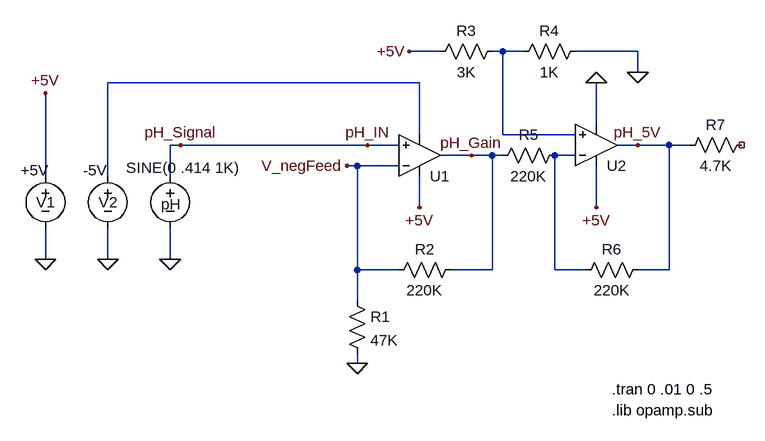
[diagram p0: schematic pHCircuit_V01.asc]
pHCircuit_V01.asc, the LTspice schematic file:
Version 4
SHEET 1 1940 680
WIRE 64 -128 16 -128
WIRE 160 -128 144 -128
WIRE 192 -128 160 -128
WIRE 368 -128 272 -128
WIRE 368 -96 368 -128
WIRE 32 -80 -448 -80
WIRE 304 -16 304 -80
WIRE 32 0 32 -80
WIRE 160 0 160 -128
WIRE 272 0 160 0
WIRE -336 16 -352 16
WIRE -48 16 -336 16
WIRE 0 16 -48 16
WIRE 368 16 336 16
WIRE 416 16 368 16
WIRE 448 16 416 16
WIRE 112 32 64 32
WIRE 144 32 112 32
WIRE 160 32 144 32
WIRE 272 32 240 32
WIRE -64 48 -80 48
WIRE 0 48 -64 48
WIRE -544 64 -544 -64
WIRE -448 64 -448 -80
WIRE -352 64 -352 16
WIRE 32 112 32 64
WIRE 304 112 304 48
WIRE -544 192 -544 144
WIRE -448 192 -448 144
WIRE -352 192 -352 144
WIRE -64 208 -64 48
WIRE 0 208 -64 208
WIRE 144 208 144 32
WIRE 144 208 80 208
WIRE 240 208 240 32
WIRE 288 208 240 208
WIRE 416 208 416 16
WIRE 416 208 368 208
WIRE -64 256 -64 208
WIRE -64 352 -64 336
FLAG -48 16 pH_IN
FLAG -352 192 0
FLAG -64 352 0
FLAG 112 32 pH_Gain
FLAG -80 48 V_negFeed
FLAG -448 192 0
FLAG -336 16 pH_Signal
FLAG 32 112 +5V
FLAG -544 -64 +5V
FLAG -544 192 0
FLAG 304 112 +5V
FLAG 304 -80 0
FLAG 368 -96 0
FLAG 16 -128 +5V
FLAG 368 16 pH_5V
SYMBOL voltage -352 48 R0
WINDOW 3 -68 3 Left 2
WINDOW 123 -249 109 Left 2
WINDOW 39 0 0 Left 2
WINDOW 0 -14 59 Left 2
SYMATTR Value SINE(0 .414 1K)
SYMATTR InstName pH
SYMBOL res 96 192 R90
WINDOW 0 0 56 VBottom 2
WINDOW 3 32 56 VTop 2
SYMATTR InstName R2
SYMATTR Value 220K
SYMBOL res -80 240 R0
SYMATTR InstName R1
SYMATTR Value 47K
SYMBOL Opamps\\UniversalOpamp2 32 32 M180
SYMATTR InstName U1
SYMBOL voltage -448 48 R0
WINDOW 0 -14 56 Left 2
WINDOW 3 -38 7 Left 2
WINDOW 123 0 0 Left 2
WINDOW 39 0 0 Left 2
SYMATTR InstName V2
SYMATTR Value -5V
SYMBOL voltage -544 48 R0
WINDOW 0 -14 56 Left 2
WINDOW 3 -38 7 Left 2
WINDOW 123 0 0 Left 2
WINDOW 39 0 0 Left 2
SYMATTR InstName V1
SYMATTR Value +5V
SYMBOL Opamps\\UniversalOpamp2 304 16 M180
SYMATTR InstName U2
SYMBOL res 160 -144 R90
WINDOW 0 0 56 VBottom 2
WINDOW 3 32 56 VTop 2
SYMATTR InstName R3
SYMATTR Value 3K
SYMBOL res 288 -144 R90
WINDOW 0 0 56 VBottom 2
WINDOW 3 32 56 VTop 2
SYMATTR InstName R4
SYMATTR Value 1K
SYMBOL res 256 16 R90
WINDOW 0 0 56 VBottom 2
WINDOW 3 32 56 VTop 2
SYMATTR InstName R5
SYMATTR Value 220K
SYMBOL res 384 192 R90
WINDOW 0 0 56 VBottom 2
WINDOW 3 32 56 VTop 2
SYMATTR InstName R6
SYMATTR Value 220K
SYMBOL res 544 0 R90
WINDOW 0 0 56 VBottom 2
WINDOW 3 32 56 VTop 2
SYMATTR InstName R7
SYMATTR Value 4.7K
TEXT 328 392 Left 2 !.tran 0 .01 0 .5
TEXT 328 424 Left 2 !.lib opamp.sub

The netlist it stands for:
* pHCircuit_V01.asc
V§pH pH_Signal 0 SINE(0 .414 1K)
R2 pH_Gain V_negFeed 220K
R1 V_negFeed 0 47K
XU1 pH_Signal V_negFeed +5V N002 pH_Gain level.2 Avol=1Meg GBW=10Meg Slew=10Meg ilimit=25m rail=0 Vos=0 phimargin=45 en=0 enk=0 in=0 ink=0 Rin=500Meg  ; pins IN+ IN- V+ V- OUT
V2 N002 0 -5V
V1 +5V 0 +5V
XU2 N001 N003 +5V 0 pH_5V level.2 Avol=1Meg GBW=10Meg Slew=10Meg ilimit=25m rail=0 Vos=0 phimargin=45 en=0 enk=0 in=0 ink=0 Rin=500Meg  ; pins IN+ IN- V+ V- OUT
R3 N001 +5V 3K
R4 0 N001 1K
R5 N003 pH_Gain 220K
R6 pH_5V N003 220K
R7 NC_01 pH_5V 4.7K
.tran 0 .01 0 .5
.lib opamp.sub
.lib UniversalOpamps2.sub
.backanno
.end